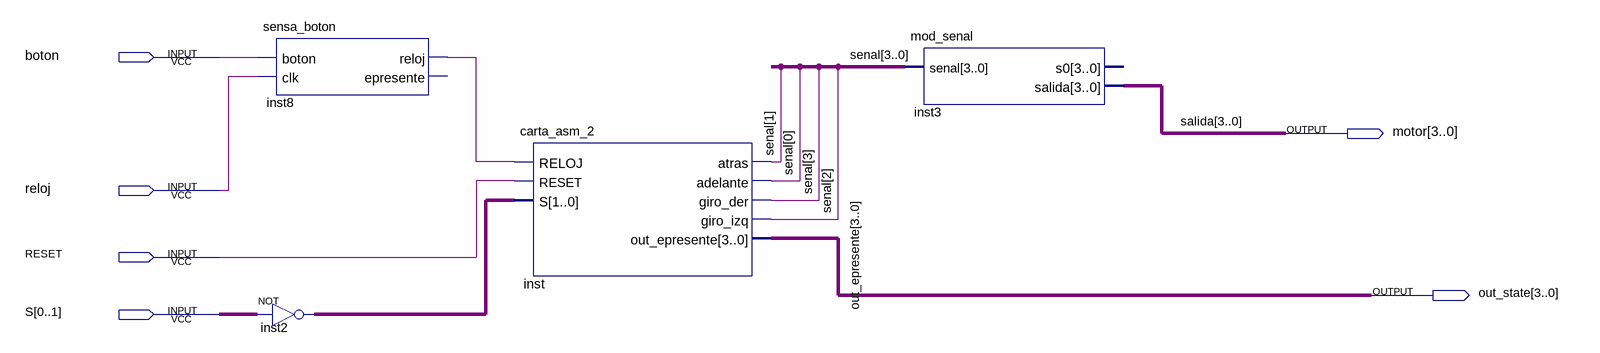
[diagram p0: schematic sheet]
// Quartus schematic Practica2.bdf as structural Verilog: 4 symbols, 6 pins
module Practica2 (
  input  boton,
  input  reloj,
  input  RESET,
  input  [0:1] S,
  output [3:0] motor,
  output [3:0] out_state
);

  wire inst8_reloj;
  wire [1:0] inst2_out;
  wire [3:0] senal;

  sensa_boton inst8 (.boton(boton), .clk(reloj), .reloj(inst8_reloj));  // open: epresente
  assign inst2_out = ~S;  // NOT inst2, 2 bits wide
  carta_asm_2 inst (
    .RELOJ(inst8_reloj), .RESET(RESET), .S(inst2_out), .atras(senal[1]), .adelante(senal[0]),
    .giro_der(senal[3]), .giro_izq(senal[2]), .out_epresente(out_state));
  mod_senal inst3 (.senal(senal), .salida(motor));  // open: s0

  // Other names for the same wires on the sheet: out_epresente[3:0] = out_state; salida[3:0] = motor
endmodule
